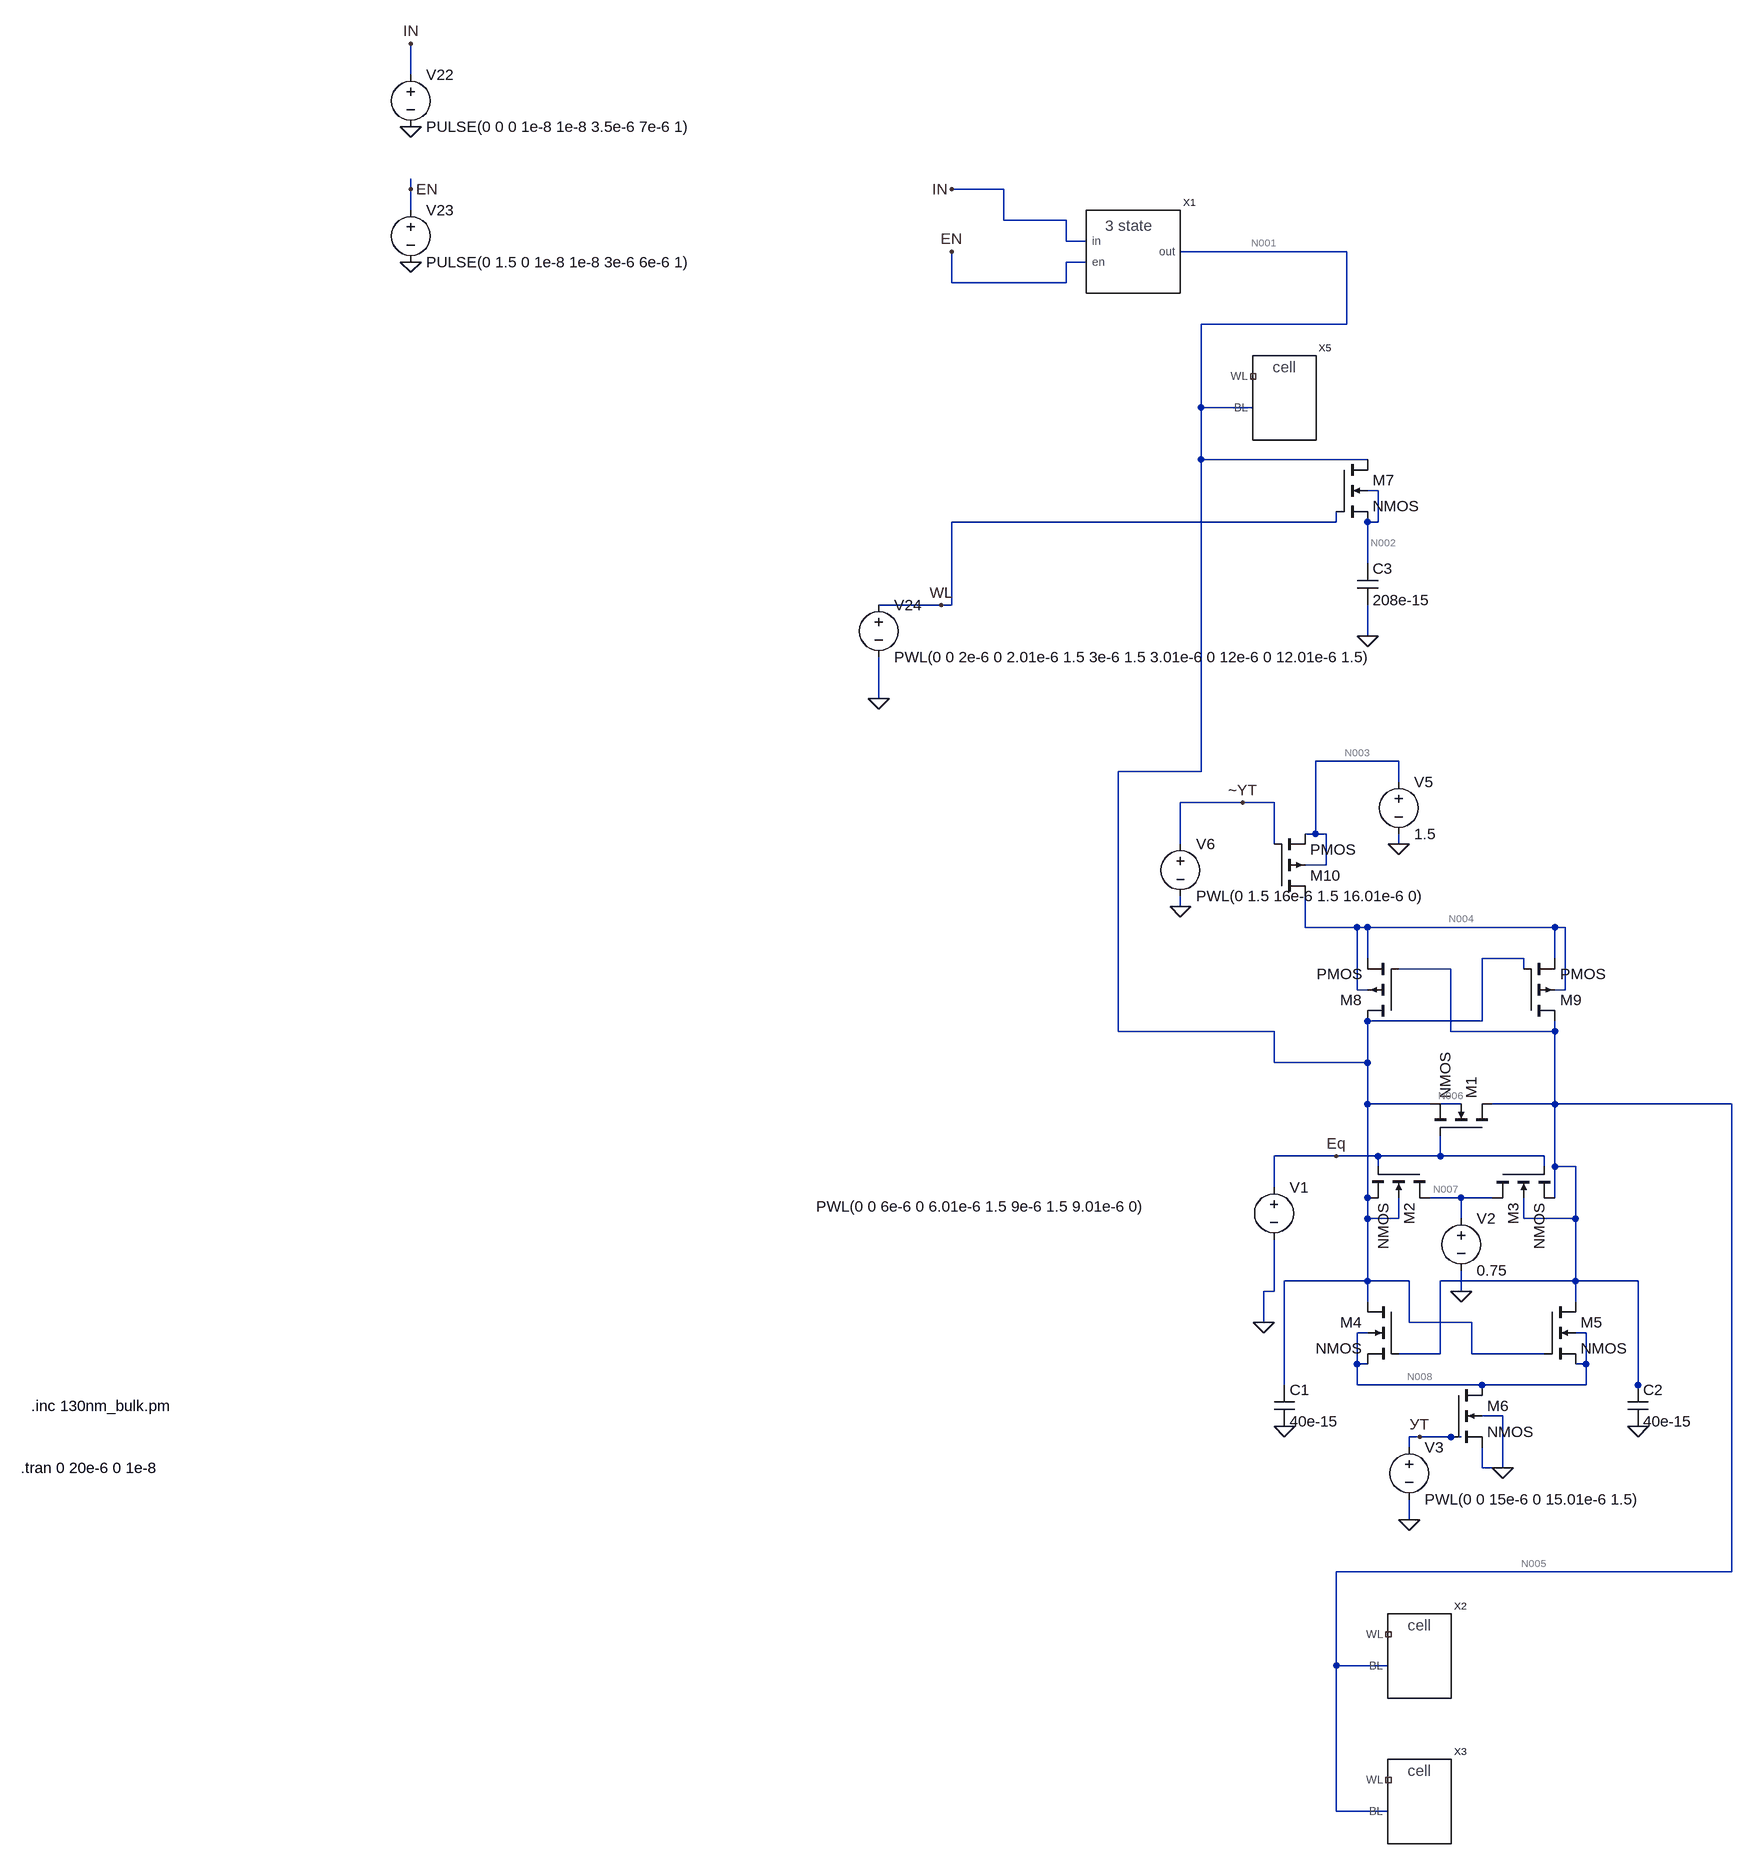
[diagram p0: schematic Draft2.asc]
Draft2.asc, the LTspice schematic file:
Version 4
SHEET 1 4548 1444
WIRE -928 -1360 -928 -1408
WIRE -928 -1184 -928 -1200
WIRE -16 -1184 -96 -1184
WIRE -928 -1152 -928 -1184
WIRE -16 -1136 -16 -1184
WIRE 80 -1136 -16 -1136
WIRE 80 -1104 80 -1136
WIRE 112 -1104 80 -1104
WIRE 512 -1088 256 -1088
WIRE 112 -1072 80 -1072
WIRE -96 -1040 -96 -1088
WIRE 80 -1040 80 -1072
WIRE 80 -1040 -96 -1040
WIRE 512 -976 512 -1088
WIRE 512 -976 288 -976
WIRE 288 -848 288 -976
WIRE 368 -848 288 -848
WIRE 288 -768 288 -848
WIRE 544 -768 288 -768
WIRE 560 -720 544 -720
WIRE 496 -672 496 -688
WIRE 496 -672 -96 -672
WIRE 560 -672 560 -720
WIRE 560 -672 544 -672
WIRE 544 -608 544 -672
WIRE -112 -544 -208 -544
WIRE -96 -544 -96 -672
WIRE -96 -544 -112 -544
WIRE 544 -496 544 -544
WIRE -208 -400 -208 -464
WIRE 592 -304 464 -304
WIRE 288 -288 288 -768
WIRE 288 -288 160 -288
WIRE 592 -272 592 -304
WIRE 352 -240 256 -240
WIRE 400 -240 352 -240
WIRE 464 -192 464 -304
WIRE 464 -192 448 -192
WIRE 480 -192 464 -192
WIRE 256 -176 256 -240
WIRE 400 -176 400 -240
WIRE 592 -176 592 -192
WIRE 480 -144 480 -192
WIRE 480 -144 448 -144
WIRE 256 -80 256 -96
WIRE 448 -48 448 -96
WIRE 528 -48 448 -48
WIRE 544 -48 528 -48
WIRE 832 -48 544 -48
WIRE 848 -48 832 -48
WIRE 544 0 544 -48
WIRE 784 0 720 0
WIRE 832 0 832 -48
WIRE 672 16 592 16
WIRE 784 16 784 0
WIRE 528 48 528 -48
WIRE 544 48 528 48
WIRE 848 48 848 -48
WIRE 848 48 832 48
WIRE 720 96 720 0
WIRE 720 96 544 96
WIRE 160 112 160 -288
WIRE 400 112 160 112
WIRE 672 112 672 16
WIRE 832 112 832 96
WIRE 832 112 672 112
WIRE 400 160 400 112
WIRE 544 160 544 96
WIRE 544 160 400 160
WIRE 544 224 544 160
WIRE 640 224 544 224
WIRE 688 224 656 224
WIRE 832 224 832 112
WIRE 832 224 736 224
WIRE 1104 224 832 224
WIRE 496 304 400 304
WIRE 560 304 496 304
WIRE 656 304 656 272
WIRE 656 304 560 304
WIRE 816 304 656 304
WIRE 560 320 560 304
WIRE 816 320 816 304
WIRE 832 320 832 224
WIRE 864 320 832 320
WIRE 400 352 400 304
WIRE 544 368 544 224
WIRE 688 368 640 368
WIRE 736 368 688 368
WIRE 832 368 832 320
WIRE 544 400 544 368
WIRE 592 400 592 368
WIRE 592 400 544 400
WIRE 688 400 688 368
WIRE 784 400 784 368
WIRE 864 400 864 320
WIRE 864 400 784 400
WIRE 544 496 544 400
WIRE 544 496 416 496
WIRE 608 496 544 496
WIRE 864 496 864 400
WIRE 864 496 656 496
WIRE 960 496 864 496
WIRE 400 512 400 432
WIRE 400 512 384 512
WIRE 688 512 688 480
WIRE 544 528 544 496
WIRE 864 528 864 496
WIRE 384 560 384 512
WIRE 608 560 608 496
WIRE 704 560 608 560
WIRE 544 576 528 576
WIRE 880 576 864 576
WIRE 656 608 656 496
WIRE 656 608 592 608
WIRE 704 608 704 560
WIRE 816 608 704 608
WIRE 528 624 528 576
WIRE 544 624 528 624
WIRE 880 624 880 576
WIRE 880 624 864 624
WIRE 416 656 416 496
WIRE 528 656 528 624
WIRE 720 656 528 656
WIRE 880 656 880 624
WIRE 880 656 720 656
WIRE 960 656 960 496
WIRE 960 672 960 656
WIRE 752 704 720 704
WIRE 624 736 608 736
WIRE 672 736 624 736
WIRE 688 736 672 736
WIRE 608 752 608 736
WIRE 720 784 720 752
WIRE 752 784 752 704
WIRE 752 784 720 784
WIRE 608 864 608 832
WIRE 1104 944 1104 224
WIRE 1104 944 496 944
WIRE 496 1088 496 944
WIRE 576 1088 496 1088
WIRE 496 1312 496 1088
WIRE 576 1312 496 1312
FLAG 384 560 0
FLAG 688 512 0
FLAG 960 720 0
FLAG 416 720 0
FLAG 752 784 0
FLAG 608 864 0
FLAG -208 -400 0
FLAG 496 304 Eq
FLAG 624 736 УТ
FLAG -112 -544 WL
FLAG 592 -176 0
FLAG 256 -80 0
FLAG 352 -240 ~YT
FLAG -928 -1072 0
FLAG -928 -1280 0
FLAG -928 -1184 EN
FLAG -96 -1088 EN
FLAG -96 -1184 IN
FLAG -928 -1408 IN
FLAG 544 -496 0
SYMBOL nmos4 736 272 M270
SYMATTR InstName M1
SYMATTR Value2 l=130e-9 w=1300e-9 ad=676000e-18 as=676000e-18 pd=3640e-9 ps=3640e-9
SYMBOL nmos4 640 320 R90
SYMATTR InstName M2
SYMATTR Value2 l=130e-9 w=1300e-9 ad=676000e-18 as=676000e-18 pd=3640e-9 ps=3640e-9
SYMBOL nmos4 736 320 M90
SYMATTR InstName M3
SYMATTR Value2 l=130e-9 w=1300e-9 ad=676000e-18 as=676000e-18 pd=3640e-9 ps=3640e-9
SYMBOL voltage 400 336 R0
WINDOW 3 -704 45 Left 2
WINDOW 123 0 0 Left 0
WINDOW 39 0 0 Left 0
SYMATTR Value PWL(0 0 6e-6 0 6.01e-6 1.5 9e-6 1.5 9.01e-6 0)
SYMATTR InstName V1
SYMBOL voltage 688 384 R0
WINDOW 123 0 0 Left 0
WINDOW 39 0 0 Left 0
SYMATTR InstName V2
SYMATTR Value 0.75
SYMBOL cap 400 656 R0
SYMATTR InstName C1
SYMATTR Value 40e-15
SYMBOL cap 944 656 R0
SYMATTR InstName C2
SYMATTR Value 40e-15
SYMBOL nmos4 592 528 M0
SYMATTR InstName M4
SYMATTR Value2 l=130e-9 w=1300e-9 ad=676000e-18 as=676000e-18 pd=3640e-9 ps=3640e-9
SYMBOL nmos4 816 528 R0
SYMATTR InstName M5
SYMATTR Value2 l=130e-9 w=1300e-9 ad=676000e-18 as=676000e-18 pd=3640e-9 ps=3640e-9
SYMBOL nmos4 672 656 R0
SYMATTR InstName M6
SYMATTR Value2 l=130e-9 w=1300e-9 ad=676000e-18 as=676000e-18 pd=3640e-9 ps=3640e-9
SYMBOL voltage 608 736 R0
WINDOW 123 0 0 Left 0
WINDOW 39 0 0 Left 0
SYMATTR InstName V3
SYMATTR Value PWL(0 0 15e-6 0 15.01e-6 1.5)
SYMBOL pmos4 592 96 R180
SYMATTR InstName M8
SYMATTR Value2 l=130e-9 w=2600e-9 ad=676000e-18 as=676000e-18 pd=3640e-9 ps=3640e-9
SYMBOL pmos4 784 96 M180
SYMATTR InstName M9
SYMATTR Value2 l=130e-9 w=12600e-9 ad=676000e-18 as=676000e-18 pd=3640e-9 ps=3640e-9
SYMBOL pmos4 400 -96 M180
SYMATTR InstName M10
SYMATTR Value2 l=130e-9 w=2600e-9 ad=676000e-18 as=676000e-18 pd=3640e-9 ps=3640e-9
SYMBOL voltage 592 -288 R0
WINDOW 123 0 0 Left 0
WINDOW 39 0 0 Left 0
SYMATTR InstName V5
SYMATTR Value 1.5
SYMBOL voltage 256 -192 R0
WINDOW 123 0 0 Left 0
WINDOW 39 0 0 Left 0
SYMATTR InstName V6
SYMATTR Value PWL(0 1.5 16e-6 1.5 16.01e-6 0)
SYMBOL voltage -928 -1376 R0
WINDOW 123 0 0 Left 0
WINDOW 39 0 0 Left 0
SYMATTR InstName V22
SYMATTR Value PULSE(0 0 0 1e-8 1e-8 3.5e-6 7e-6 1)
SYMBOL voltage -928 -1168 R0
WINDOW 123 0 0 Left 0
WINDOW 39 0 0 Left 0
SYMATTR InstName V23
SYMATTR Value PULSE(0 1.5 0 1e-8 1e-8 3e-6 6e-6 1)
SYMBOL voltage -208 -560 R0
WINDOW 123 0 0 Left 0
WINDOW 39 0 0 Left 0
SYMATTR InstName V24
SYMATTR Value PWL(0 0 2e-6 0 2.01e-6 1.5 3e-6 1.5 3.01e-6 0 12e-6 0 12.01e-6 1.5)
SYMBOL three_state_new 192 -1120 R0
SYMATTR InstName X1
SYMBOL memory_cell 656 1072 R0
SYMATTR InstName X2
SYMBOL memory_cell 656 1296 R0
SYMATTR InstName X3
SYMBOL memory_cell 448 -864 R0
SYMATTR InstName X5
SYMBOL nmos4 496 -768 R0
SYMATTR InstName M7
SYMATTR Value2 l=130e-9 w=1300e-9 ad=676000e-18 as=676000e-18 pd=3640e-9 ps=3640e-9
SYMBOL cap 528 -608 R0
SYMATTR InstName C3
SYMATTR Value 208e-15
SYMATTR SpiceLine V=1.5 Irms=0 Rser=0 Lser=0
TEXT -1512 688 Left 2 !.inc 130nm_bulk.pm
TEXT -1528 784 Left 2 !.tran 0 20e-6 0 1e-8

The netlist it stands for:
* Draft2.asc
M1 N005 Eq N001 N006 NMOS l=130e-9 w=1300e-9 ad=676000e-18 as=676000e-18 pd=3640e-9 ps=3640e-9
M2 N007 Eq N001 N001 NMOS l=130e-9 w=1300e-9 ad=676000e-18 as=676000e-18 pd=3640e-9 ps=3640e-9
M3 N007 Eq N005 N005 NMOS l=130e-9 w=1300e-9 ad=676000e-18 as=676000e-18 pd=3640e-9 ps=3640e-9
V1 Eq 0 PWL(0 0 6e-6 0 6.01e-6 1.5 9e-6 1.5 9.01e-6 0)
V2 N007 0 0.75
C1 N001 0 40e-15
C2 N005 0 40e-15
M4 N001 N005 N008 N008 NMOS l=130e-9 w=1300e-9 ad=676000e-18 as=676000e-18 pd=3640e-9 ps=3640e-9
M5 N005 N001 N008 N008 NMOS l=130e-9 w=1300e-9 ad=676000e-18 as=676000e-18 pd=3640e-9 ps=3640e-9
M6 N008 УТ 0 0 NMOS l=130e-9 w=1300e-9 ad=676000e-18 as=676000e-18 pd=3640e-9 ps=3640e-9
V3 УТ 0 PWL(0 0 15e-6 0 15.01e-6 1.5)
M8 N001 N005 N004 N004 PMOS l=130e-9 w=2600e-9 ad=676000e-18 as=676000e-18 pd=3640e-9 ps=3640e-9
M9 N005 N001 N004 N004 PMOS l=130e-9 w=12600e-9 ad=676000e-18 as=676000e-18 pd=3640e-9 ps=3640e-9
M10 N004 ~YT N003 N003 PMOS l=130e-9 w=2600e-9 ad=676000e-18 as=676000e-18 pd=3640e-9 ps=3640e-9
V5 N003 0 1.5
V6 ~YT 0 PWL(0 1.5 16e-6 1.5 16.01e-6 0)
V22 IN 0 PULSE(0 0 0 1e-8 1e-8 3.5e-6 7e-6 1)
V23 EN 0 PULSE(0 1.5 0 1e-8 1e-8 3e-6 6e-6 1)
V24 WL 0 PWL(0 0 2e-6 0 2.01e-6 1.5 3e-6 1.5 3.01e-6 0 12e-6 0 12.01e-6 1.5)
XX1 IN EN N001 three_state_new  ; pins in en out
XX2 NC_01 N005 memory_cell  ; pins WL BL
XX3 NC_02 N005 memory_cell  ; pins WL BL
XX5 NC_03 N001 memory_cell  ; pins WL BL
M7 N001 WL N002 N002 NMOS l=130e-9 w=1300e-9 ad=676000e-18 as=676000e-18 pd=3640e-9 ps=3640e-9
C3 N002 0 208e-15 V=1.5 Irms=0 Rser=0 Lser=0
.model NMOS NMOS
.model PMOS PMOS
.lib standard.mos
.inc 130nm_bulk.pm
.tran 0 20e-6 0 1e-8
.backanno
.end

* Results of the author's LTspice run, read from the files saved beside the schematic
* Operating Point, zero values left out:
*   V(n005) = 982 mV
*   V(n001) = 765 mV
*   V(n006) = 582.5 mV
*   V(n007) = 750 mV
*   V(n008) = 764.7 mV
*   V(n004) = 982.1 mV
*   V(~yt) = 1.5 V
*   V(n003) = 1.5 V
*   V(n002) = 323.8 mV
*   Id(M10) = -7.82 nA
*   Is(M10) = 7.82 nA
*   Id(M9) = -4.311 nA
*   Is(M9) = 4.311 nA
*   Id(M8) = -3.51 nA
*   Is(M8) = 3.509 nA
*   Id(M7) = 50.96 pA
*   Ig(M7) = -50.96 pA
*   Id(M6) = 12.13 nA
*   Ig(M6) = -49.72 pA
*   Is(M6) = -12.08 nA
*   Id(M5) = 3.851 nA
*   Is(M5) = -3.85 nA
*   Id(M4) = 8.281 nA
*   Is(M4) = -8.282 nA
*   Id(M3) = 42.69 pA
*   Ig(M3) = -273.8 pA
*   Ib(M3) = 4.733 pA
*   Is(M3) = 226.4 pA
*   Id(M2) = 44.64 pA
*   Ig(M2) = -94.48 pA
*   Is(M2) = 49.82 pA
*   Id(M1) = 226.8 pA
*   Ig(M1) = -276.2 pA
*   Is(M1) = 50 pA
*   I(V24) = 50.96 pA
*   I(V23) = 6.094 nA
*   I(V22) = 6.094 nA
*   I(V5) = -7.82 nA
*   I(V3) = 49.72 pA
*   I(V2) = -87.33 pA
*   I(V1) = 644.5 pA
*   Ix(x1:IN) = -6.094 nA
*   Ix(x1:EN) = -6.094 nA
*   Ix(x1:OUT) = -4.923 nA
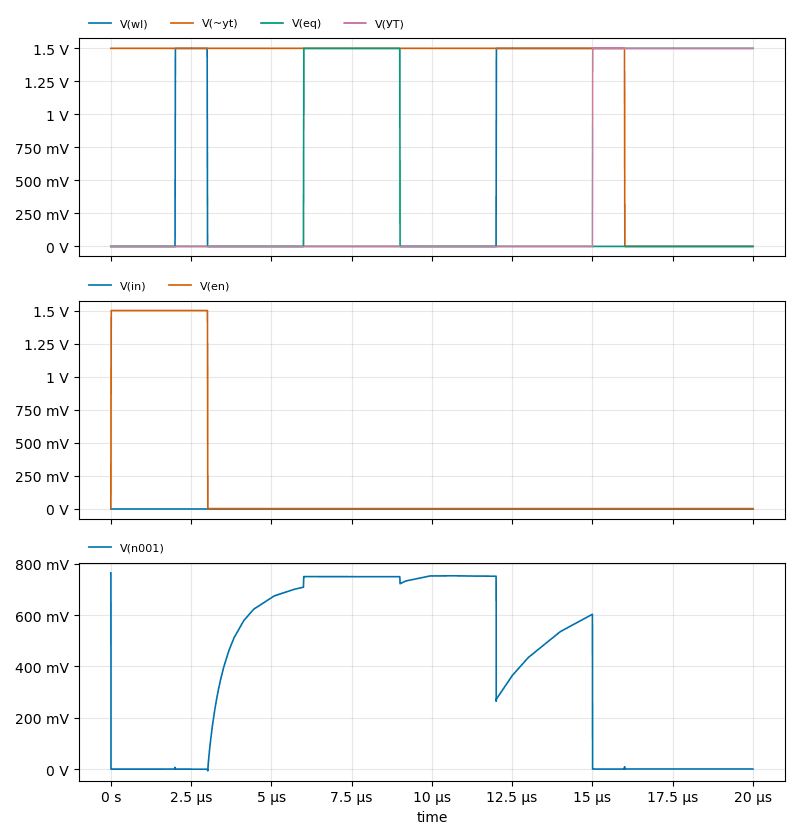
[diagram p1: Transient Analysis of Draft2.asc, plotted from the saved traces]
* Transient Analysis, 1 run:
*   V(wl): min 0 V, max 1.5 V, average 674.6 mV, rms 1.006 V, last 1.5 V
*   V(~yt): min 0 V, max 1.5 V, average 1.2 V, rms 1.342 V, last 0 V
*   V(eq): min 0 V, max 1.5 V, average 225 mV, rms 580.6 mV, last 0 V
*   V(УТ): min 0 V, max 1.5 V, average 374.6 mV, rms 749.5 mV, last 1.5 V
*   V(in): min 0 V, max 0 V, average 0 V, rms 0 V, last 0 V
*   V(en): min 0 V, max 1.5 V, average 225.7 mV, rms 581.6 mV, last 0 V
*   V(n001): min -6.529 mV, max 765.1 mV, average 378.9 mV, rms 503.9 mV, last 502.5 µV